# Altium schematic sheet [03] - 28PINS SCHEMATIC.SchDoc (part 2 of 3)
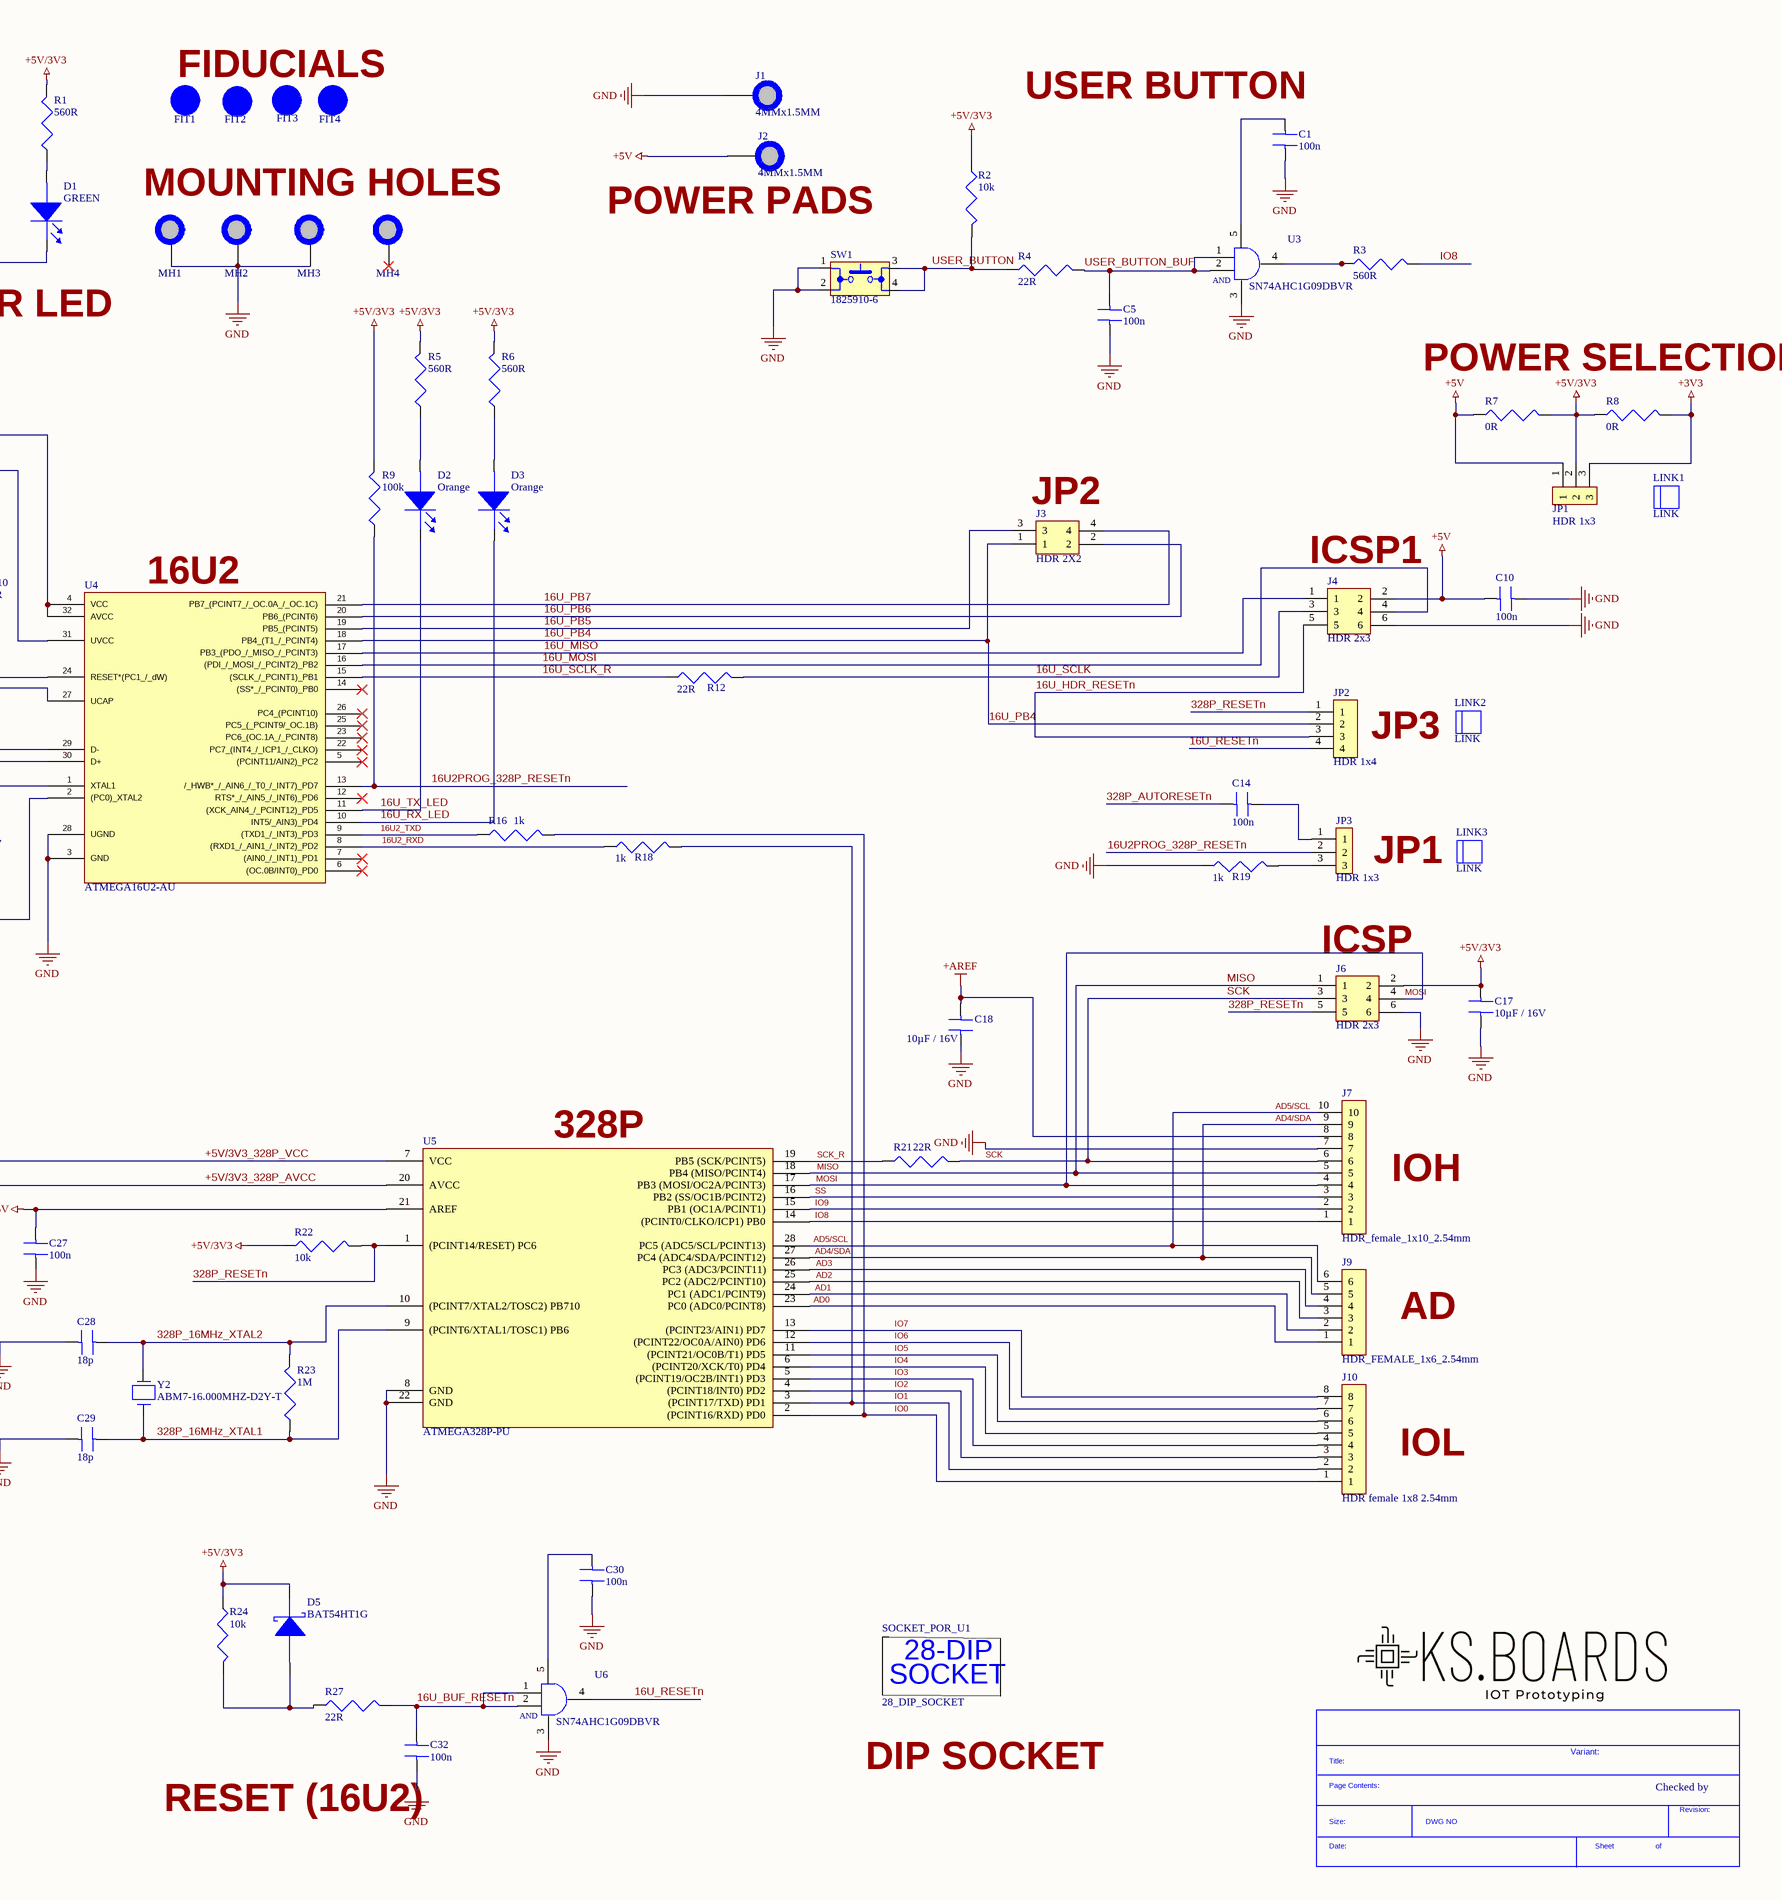
[diagram p2: [03] - 28PINS SCHEMATIC.SchDoc, right]
## Library data of the parts
C1 C2 C5 C7-C10 C14 C20-C23 C26 C27 C30-C33 = C2012X7R1H104M085AA: CAP CER 0.1UF 50V X7R 0805; Manufacturer: TDK; Dielectric Material: Ceramic; Capacitance: 100nF; Tolerance: 20%; Supplier 1: Digi-Key; Supplier Part Number 1: 445-7535-1-ND; Manufacturer Part Number: C2012X7R1H104M085AA; RoHS: Yes; Category: Ceramic Capacitors; Stock 1: 9653; Pricing 1: 1=0,15000, 10=0,10400, 50=0,05900, 100=0,04880, 500=0,03422, 1000=0,02833 (USD); Mount: Surface Mount; Case/Package: 0805; Number of Pins: 2; Weight: 0.000194oz; Case Code (Metric): 2012; Case Code (Imperial): 0805; Min Operating Temperature: -55°C; Max Operating Temperature: 125°C; Packaging: Tape and Reel; Voltage Rating: 50V; Voltage Rating (DC): 50V; Termination: SMD/SMT; Dielectric: X7R; Package Quantity: 1; Resistor Type: Ceramic; Length: 2mm; Height: 0.85mm; Width: 0.049inch; Thickness: 0.037inch; Depth: 1.25mm; Lead Free: Lead Free; REACH SVHC: Unknown; ComponentLink1URL: https://datasheet.ciiva.com/6256/tdkmlcccaprange-6256917.pdf?src-supplier=Digi-Key; ComponentLink1Description: https://datasheet.ciiva.com/6256/tdkmlcccaprange-6256917.pdf?src-supplier=Digi-Key; ComponentLink2URL: https://datasheet.ciiva.com/6256/tdkmlcccaprange-6256919.pdf?src-supplier=Digi-Key; ComponentLink2Description: https://datasheet.ciiva.com/6256/tdkmlcccaprange-6256919.pdf?src-supplier=Digi-Key
C3 C4 C6 C17-C19 C24 C25 = C2012X5R1C106M125AC: CERAMIC CAPACITOR, 10UF, 16V, X5R, 20%, 0805, FULL REEL; Product Range:C Series; Capacitance:10 F; Capacitance Tolerance: 20%; Dielectric Characteristic:X5R; Voltage Rating:16V; Ceramic Capacitor Case:0805 [2012 Metric]; MSL:- ;RoHS Compliant: Yes; Manufacturer: TDK; Supplier 1: Digi-Key; Supplier Part Number 1: 445-4115-2-ND; Manufacturer Part Number: C2012X5R1C106M125AC; RoHS: Yes; Category: Ceramic Capacitors; Mount: Surface Mount; Case/Package: 0805; Number of Pins: 2; Weight: 0.000194oz; Case Code (Metric): 2012; Case Code (Imperial): 0805; Dielectric Material: Ceramic; Min Operating Temperature: -55°C; Max Operating Temperature: 85°C; Termination: SMD/SMT; Capacitance: 10uF; Tolerance: 20%; Voltage Rating: 16V; Packaging: Tape and Reel; Voltage Rating (DC): 16V; Dielectric: X5R; Resistor Type: Ceramic; Package Quantity: 1; Length: 2mm; Height: 1.25mm; Depth: 1.25mm; Width: 0.049inch; Thickness: 0.057inch; REACH SVHC: No SVHC; Lead Free: Lead Free; ComponentLink1URL: https://datasheet.ciiva.com/6289/tdkmlcccaprange-6289238.pdf?src-supplier=Digi-Key; ComponentLink1Description: https://datasheet.ciiva.com/6289/tdkmlcccaprange-6289238.pdf?src-supplier=Digi-Key; ComponentLink2URL: https://datasheet.ciiva.com/22725/1913358-22725558.pdf?src-supplier=Element14; ComponentLink2Description: https://datasheet.ciiva.com/22725/1913358-22725558.pdf?src-supplier=Element14; ComponentLink3URL: https://datasheet.ciiva.com/6252/tdkmlcccaprange-6252105.pdf?src-supplier=Digi-Key; ComponentLink3Description: https://datasheet.ciiva.com/6252/tdkmlcccaprange-6252105.pdf?src-supplier=Digi-Key; ComponentLink4URL: https://datasheet.ciiva.com/6252/tdkmlcccaprange-6252108.pdf?src-supplier=Digi-Key; ComponentLink4Description: https://datasheet.ciiva.com/6252/tdkmlcccaprange-6252108.pdf?src-supplier=Digi-Key; ComponentLink5URL: https://datasheet.ciiva.com/23803/1796654-23803022.pdf?src-supplier=Newark; ComponentLink5Description: https://datasheet.ciiva.com/23803/1796654-23803022.pdf?src-supplier=Newark
C11 C12 = EEE-1AA101WR: Cap Aluminum 100uF 10V 20% (5 X 5.4mm) SMD 50mA 1000 hr 85°C T/R; Manufacturer: Panasonic; Life (Hours): 1000Hour; Supplier 1: Digi-Key; Supplier Part Number 1: PCE3867CT-ND; Manufacturer Part Number: EEE-1AA101WR; RoHS: Yes; Category: Aluminum Electrolytic Capacitors; Stock 1: 120840; Pricing 1: 1=0,34000, 10=0,23100, 50=0,15400, 100=0,13090, 500=0,09240 (USD); Mount: Surface Mount,PCB; Case/Package: Radial; Contact Plating: Tin; Min Operating Temperature: -40°C; Max Operating Temperature: 85°C; Capacitance: 100uF; Tolerance: 20%; Ripple Current: 50mA; Voltage Rating: 10V; Packaging: Tape and Reel; Package Quantity: 1; Voltage Rating (DC): 10V; Termination: SMD/SMT; Ripple Current (AC): 50mA; Diameter: 5mm; Length: 5.5mm; Height: 5.4mm; Height - Seated (Max): 0.213inch; Radiation Hardening: No; Lead Free: Lead Free; REACH SVHC: Unknown; ComponentLink1URL: https://datasheet.ciiva.com/26945/getdatasheetpartid-169213-26945071.pdf?src-supplier=Verical; ComponentLink1Description: https://datasheet.ciiva.com/26945/getdatasheetpartid-169213-26945071.pdf?src-supplier=Verical; ComponentLink2URL: https://datasheet.ciiva.com/2983/aba0000ce2-2983906.pdf?src-supplier=Avnet; ComponentLink2Description: https://datasheet.ciiva.com/2983/aba0000ce2-2983906.pdf?src-supplier=Avnet; ComponentLink3URL: https://datasheet.ciiva.com/30075/11aba0000ce2-30075303.pdf?src-supplier=Onlinecomponents.com; ComponentLink3Description: https://datasheet.ciiva.com/30075/11aba0000ce2-30075303.pdf?src-supplier=Onlinecomponents.com; ComponentLink4URL: https://datasheet.ciiva.com/16427/aba0000ce2-16427544.pdf?src-supplier=Future+Electronics; ComponentLink4Description: https://datasheet.ciiva.com/16427/aba0000ce2-16427544.pdf?src-supplier=Future+Electronics; ComponentLink5URL: https://datasheet.ciiva.com/14598/70255710-14598233.pdf?src-supplier=Allied+Electronics; ComponentLink5Description: https://datasheet.ciiva.com/14598/70255710-14598233.pdf?src-supplier=Allied+Electronics; ComponentLink6URL: https://datasheet.ciiva.com/14605/70255710-14605689.pdf?src-supplier=Allied+Electronics; ComponentLink6Description: https://datasheet.ciiva.com/14605/70255710-14605689.pdf?src-supplier=Allied+Electronics; ComponentLink7URL: https://datasheet.ciiva.com/11673/aba0000ce2-11673882.pdf?src-supplier=Avnet; ComponentLink7Description: https://datasheet.ciiva.com/11673/aba0000ce2-11673882.pdf?src-supplier=Avnet; ComponentLink8URL: https://datasheet.ciiva.com/24027/aba0000ce2-40801-24027541.pdf?src-supplier=Mouser; ComponentLink8Description: https://datasheet.ciiva.com/24027/aba0000ce2-40801-24027541.pdf?src-supplier=Mouser
C13 = C2012X5R1E105K125AA: TDK - C2012X5R1E105K125AA - SMD Multilayer Ceramic Capacitor, 1 µF, 25 V, 0805 [2012 Metric], ± 10%, X5R, C Series; Capacitance: 1uF; Voltage Rating: 25V; Supplier 1: Digi-Key; Supplier Part Number 1: 445-1419-1-ND; Manufacturer: TDK; Manufacturer Part Number: C2012X5R1E105K125AA; RoHS: Yes; Category: Ceramic Capacitors; Stock 1: 31037; Pricing 1: 1=0,23000, 10=0,15800, 50=0,09500, 100=0,08030, 500=0,05492, 1000=0,04858 (USD); Mount: Surface Mount; Case/Package: 0805; Number of Pins: 2; Case Code (Metric): 2012; Case Code (Imperial): 0805; Dielectric Material: Ceramic; Weight: 0.000194oz; Min Operating Temperature: -55°C; Max Operating Temperature: 85°C; Packaging: Tape and Reel; Voltage Rating (DC): 25V; Termination: SMD/SMT; Dielectric: X5R; Tolerance: 10%; Package Quantity: 2000; Resistor Type: Ceramic; Voltage: 25V; Length: 2mm; Width: 0.049inch; Height: 1.25mm; Depth: 1.25mm; Thickness: 0.057inch; Radiation Hardening: No; Lead Free: Lead Free; REACH SVHC: No SVHC; ComponentLink1URL: https://datasheet.ciiva.com/11787/0900766b80c1bb00-11787608.pdf?src-supplier=RSComponents; ComponentLink1Description: https://datasheet.ciiva.com/11787/0900766b80c1bb00-11787608.pdf?src-supplier=RSComponents; ComponentLink2URL: https://datasheet.ciiva.com/16449/e412-c-16449595.pdf?src-supplier=Future+Electronics; ComponentLink2Description: https://datasheet.ciiva.com/16449/e412-c-16449595.pdf?src-supplier=Future+Electronics; ComponentLink3URL: https://datasheet.ciiva.com/28602/1744655-28602171.pdf?src-supplier=Element14; ComponentLink3Description: https://datasheet.ciiva.com/28602/1744655-28602171.pdf?src-supplier=Element14; ComponentLink4URL: https://datasheet.ciiva.com/15192/getdatasheetpartid-726707-15192140.pdf?src-supplier=Verical; ComponentLink4Description: https://datasheet.ciiva.com/15192/getdatasheetpartid-726707-15192140.pdf?src-supplier=Verical
C15 C16 C28 C29 = C0805C180J5GAC7210: Cap Ceramic 18pF 50V C0G 5% SMD 0805 125C Plastic T/R; Manufacturer: KEMET; Supplier 1: Digi-Key; Supplier Part Number 1: 399-C0805C180J5GAC7210CT-ND; Manufacturer Part Number: C0805C180J5GAC7210; RoHS: Yes; Category: Ceramic Capacitors; Stock 1: 14815; Pricing 1: 1=0,12000, 10=0,08600, 50=0,04900, 100=0,04070, 500=0,02852, 1000=0,02361, 2500=0,02197, 5000=0,02010 (USD); Case/Package: 0805; Dielectric Material: Ceramic; Min Operating Temperature: -55°C; Max Operating Temperature: 125°C; Packaging: Tape and Reel; Tolerance: 5%; Capacitance: 18pF; Dielectric: C0G; Voltage Rating (DC): 50V; Length: 2mm; Depth: 1.25mm; Lead Free: Lead Free; ComponentLink1URL: http://components.arrow.com/part/dataview/0323_00325677?src-supplier=Arrow+Europe; ComponentLink1Description: http://components.arrow.com/part/dataview/0323_00325677?src-supplier=Arrow+Europe
D1 D4 = LGL29K-G2J1-24-Z: LED Uni-Color Green 572nm 2-Pin Chip 0603(1608Metric) T/R; Manufacturer: Osram Opto; Lens Color: White; Forward Current: 20mA; Forward Voltage: 2.2V; Luminous Intensity: 5.6mcd; Viewing Angle: 160°; Number of LEDs: 1; Lens Style: Flat,Diffused,Colorless,Rectangular; Reverse Voltage: 12V; Test Current: 2mA; Dominant Wavelength: 570nm; Luminous Flux: 0.012lm; Lens Transparency: Diffused; Lens Size: 0.8mm; Supplier 1: Digi-Key; Supplier Part Number 1: 475-2709-1-ND; Manufacturer Part Number: LGL29K-G2J1-24-Z; RoHS: Yes; Category: Uncategorized; Stock 1: 191201; Pricing 1: 1=0,47000, 10=0,30800, 100=0,20530, 500=0,14198, 1000=0,11832, 2000=0,10649 (USD); Mount: Surface Mount; Case/Package: 0603; Number of Pins: 2; Color: Green; Case Code (Imperial): 0603; Case Code (Metric): 1608; Min Operating Temperature: -40°C; Max Operating Temperature: 100°C; Packaging: Tape and Reel; Number of Elements: 1; Illumination Color: Green; Package Quantity: 5000; Length: 1.3mm; Width: 0.8mm; Height: 0.65mm; Depth: 0.8mm; Radiation Hardening: No; ComponentLink1URL: https://datasheet.ciiva.com/4689/g-l29k-39844-4689584.pdf?src-supplier=Mouser; ComponentLink1Description: https://datasheet.ciiva.com/4689/g-l29k-39844-4689584.pdf?src-supplier=Mouser; ComponentLink2URL: https://datasheet.ciiva.com/15198/getdatasheetpartid-571127-15198411.pdf?src-supplier=Verical; ComponentLink2Description: https://datasheet.ciiva.com/15198/getdatasheetpartid-571127-15198411.pdf?src-supplier=Verical; ComponentLink3URL: https://datasheet.ciiva.com/2112/00077107-0-2112886.pdf?src-supplier=Digi-Key; ComponentLink3Description: https://datasheet.ciiva.com/2112/00077107-0-2112886.pdf?src-supplier=Digi-Key; ComponentLink4URL: https://datasheet.ciiva.com/2112/00077107-0-2112887.pdf?src-supplier=Digi-Key; ComponentLink4Description: https://datasheet.ciiva.com/2112/00077107-0-2112887.pdf?src-supplier=Digi-Key; ComponentLink5URL: https://datasheet.ciiva.com/2112/00077107-0-2112888.pdf?src-supplier=Digi-Key; ComponentLink5Description: https://datasheet.ciiva.com/2112/00077107-0-2112888.pdf?src-supplier=Digi-Key
D2 D3 = LOL29K-H2K1-24-Z: OSRAM - LO L29K-H2K1-24-Z - SMARTLED 0603 ORANGE; Manufacturer: Osram Opto; Lens Color: White; Forward Current: 20mA; Forward Voltage: 2.2V; Luminous Intensity: 9mcd; Viewing Angle: 160°; Test Current: 2mA; Lens Style: Flat,Diffused,Colorless,Rectangular; Dominant Wavelength: 606nm; Luminous Flux: 0.025lm; Number of Elements: 1; Reverse Voltage: 12V; Lens Transparency: Diffused; Lens Size: 0.8mm; Supplier 1: Digi-Key; Supplier Part Number 1: 475-2740-2-ND; Manufacturer Part Number: LOL29K-H2K1-24-Z; RoHS: Yes; Category: Uncategorized; Mount: Surface Mount; Case/Package: 0603; Number of Pins: 2; Color: Orange; Case Code (Metric): 1608; Case Code (Imperial): 0603; Min Operating Temperature: -40°C; Max Operating Temperature: 100°C; Packaging: Tape and Reel; Number of LEDs: 1; Illumination Color: Orange; Package Quantity: 5000; Length: 1.3mm; Width: 0.8mm; Height: 0.65mm; Depth: 0.8mm; Radiation Hardening: No; ComponentLink1URL: https://datasheet.ciiva.com/2112/00077105-0-2112904.pdf?src-supplier=Digi-Key; ComponentLink1Description: https://datasheet.ciiva.com/2112/00077105-0-2112904.pdf?src-supplier=Digi-Key; ComponentLink2URL: https://datasheet.ciiva.com/2112/00077105-0-2112905.pdf?src-supplier=Digi-Key; ComponentLink2Description: https://datasheet.ciiva.com/2112/00077105-0-2112905.pdf?src-supplier=Digi-Key; ComponentLink3URL: https://datasheet.ciiva.com/2112/00077105-0-2112906.pdf?src-supplier=Digi-Key; ComponentLink3Description: https://datasheet.ciiva.com/2112/00077105-0-2112906.pdf?src-supplier=Digi-Key; ComponentLink4URL: https://datasheet.ciiva.com/15198/getdatasheetpartid-693885-15198412.pdf?src-supplier=Verical; ComponentLink4Description: https://datasheet.ciiva.com/15198/getdatasheetpartid-693885-15198412.pdf?src-supplier=Verical
D5 D6 = BAT54HT1G: Small Signal Schottky Diode, Single, 30 V, 200 mA, 800 mV, 600 mA, 150 C ;RoHS Compliant: Yes; Manufacturer: ON Semiconductor / Fairchild; Forward Voltage: 800mV; Forward Current: 200mA; Recovery Time: 5ns; Max Repetitive Reverse Voltage (Vrrm): 30V; Peak Non-Repetitive Surge Current: 600mA; Max Reverse Current: 2uA; Power Dissipation: 200mW; Polarity: Standard; Capacitance: 10pF; Supplier 1: Digi-Key; Supplier Part Number 1: BAT54HT1GOSCT-ND; Manufacturer Part Number: BAT54HT1G; RoHS: Yes; Category: Schottky Diodes; Stock 1: 238317; Pricing 1: 1=0,20000, 10=0,18100, 100=0,07590, 500=0,05962, 1000=0,04140 (USD); Mount: Surface Mount; Number of Pins: 2; Contact Plating: Tin,Matte; Min Operating Temperature: -55°C; Max Operating Temperature: 150°C; Packaging: Tape and Reel; Package Quantity: 3000; Average Rectified Current: 200mA; Reverse Recovery Time: 5ns; Max Forward Surge Current (Ifsm): 600mA; Element Configuration: Single; Max Reverse Voltage (DC): 30V; Max Surge Current: 600mA; Voltage Rating (DC): 30V; Current Rating: 200mA; Output Current: 200mA; Reverse Voltage: 30V; Max Reverse Leakage Current: 2uA; Length: 1.8mm; Width: 1.35mm; Height: 1mm; Radiation Hardening: No; Lead Free: Lead Free; REACH SVHC: No SVHC; ComponentLink1URL: https://datasheet.ciiva.com/4452/bat54ht1g-104602-4452889.pdf?src-supplier=Mouser; ComponentLink1Description: https://datasheet.ciiva.com/4452/bat54ht1g-104602-4452889.pdf?src-supplier=Mouser; ComponentLink2URL: https://datasheet.ciiva.com/1240/1747983-1240762.pdf?src-supplier=Newark; ComponentLink2Description: https://datasheet.ciiva.com/1240/1747983-1240762.pdf?src-supplier=Newark; ComponentLink3URL: https://datasheet.ciiva.com/34301/806549-34301562.pdf?src-supplier=Jameco; ComponentLink3Description: https://datasheet.ciiva.com/34301/806549-34301562.pdf?src-supplier=Jameco; ComponentLink4URL: https://datasheet.ciiva.com/30479/0900766b811a63a9-30479442.pdf?src-supplier=RSComponents; ComponentLink4Description: https://datasheet.ciiva.com/30479/0900766b811a63a9-30479442.pdf?src-supplier=RSComponents; ComponentLink5URL: https://datasheet.ciiva.com/4714/bat54ht1-d-72881-4714706.pdf?src-supplier=Mouser; ComponentLink5Description: https://datasheet.ciiva.com/4714/bat54ht1-d-72881-4714706.pdf?src-supplier=Mouser; ComponentLink6URL: https://datasheet.ciiva.com/910/bat54ht1g-910498.pdf?src-supplier=Digi-Key; ComponentLink6Description: https://datasheet.ciiva.com/910/bat54ht1g-910498.pdf?src-supplier=Digi-Key; ComponentLink7URL: https://datasheet.ciiva.com/46429/1727620-46429206.pdf?src-supplier=Element14; ComponentLink7Description: https://datasheet.ciiva.com/46429/1727620-46429206.pdf?src-supplier=Element14; ComponentLink8URL: https://datasheet.ciiva.com/915/bat54ht1-d-915444.pdf?src-supplier=Digi-Key; ComponentLink8Description: https://datasheet.ciiva.com/915/bat54ht1-d-915444.pdf?src-supplier=Digi-Key; ComponentLink9URL: https://datasheet.ciiva.com/910/bat54ht1g-910499.pdf?src-supplier=Digi-Key; ComponentLink9Description: https://datasheet.ciiva.com/910/bat54ht1g-910499.pdf?src-supplier=Digi-Key; ComponentLink10URL: https://datasheet.ciiva.com/8303/bat54ht1g-8303645.pdf?src-supplier=Avnet; ComponentLink10Description: https://datasheet.ciiva.com/8303/bat54ht1g-8303645.pdf?src-supplier=Avnet; ComponentLink11URL: https://datasheet.ciiva.com/1180/bat54ht1-d-1180251.pdf?src-supplier=Element14; ComponentLink11Description: https://datasheet.ciiva.com/1180/bat54ht1-d-1180251.pdf?src-supplier=Element14; ComponentLink12URL: https://datasheet.ciiva.com/1180/bat54ht1-d-1180252.pdf?src-supplier=Element14; ComponentLink12Description: https://datasheet.ciiva.com/1180/bat54ht1-d-1180252.pdf?src-supplier=Element14; ComponentLink13URL: https://datasheet.ciiva.com/8294/bat54ht1-d-8294645.pdf?src-supplier=Avnet; ComponentLink13Description: https://datasheet.ciiva.com/8294/bat54ht1-d-8294645.pdf?src-supplier=Avnet; ComponentLink14URL: https://datasheet.ciiva.com/915/bat54ht1-d-915445.pdf?src-supplier=Digi-Key; ComponentLink14Description: https://datasheet.ciiva.com/915/bat54ht1-d-915445.pdf?src-supplier=Digi-Key; ComponentLink15URL: https://datasheet.ciiva.com/915/bat54ht1-d-915443.pdf?src-supplier=Digi-Key; ComponentLink15Description: https://datasheet.ciiva.com/915/bat54ht1-d-915443.pdf?src-supplier=Digi-Key; ComponentLink16URL: https://datasheet.ciiva.com/910/bat54ht1g-910497.pdf?src-supplier=Digi-Key; ComponentLink16Description: https://datasheet.ciiva.com/910/bat54ht1g-910497.pdf?src-supplier=Digi-Key; ComponentLink17URL: https://datasheet.ciiva.com/17020/bat54ht1g-17020445.pdf?src-supplier=Future+Electronics; ComponentLink17Description: https://datasheet.ciiva.com/17020/bat54ht1g-17020445.pdf?src-supplier=Future+Electronics; ComponentLink18URL: https://datasheet.ciiva.com/48686/001262925-da-01-en-diode-schottky-30v-bat54ht1g-sod-323-fsc-48686266.pdf?src-supplier=Conrad; ComponentLink18Description: https://datasheet.ciiva.com/48686/001262925-da-01-en-diode-schottky-30v-bat54ht1g-sod-323-fsc-48686266.pdf?src-supplier=Conrad
FB1-FB3 = MPZ2012S601AT000: FERRITE BEAD 600 OHM 0805 1LN; Manufacturer: TDK; Impedance: 600R; Current Rating: 2A; DC Resistance (DCR): 100mR; Supplier 1: Digi-Key; Supplier Part Number 1: 445-2206-1-ND; Manufacturer Part Number: MPZ2012S601AT000; RoHS: Yes; Category: Ferrite Beads and Chips; Stock 1: 273606; Pricing 1: 1=0,11000, 10=0,09200, 25=0,08240, 50=0,06040, 100=0,05220, 250=0,04116, 500=0,03478, 1000=0,02928 (USD); Mount: Surface Mount; Case/Package: 0805; Case Code (Metric): 2012; Case Code (Imperial): 0805; Packaging: Tape and Reel; Package Quantity: 1; Max DC Current: 2A; Length: 0.079inch; Height: 0.041inch; Width: 0.049inch; REACH SVHC: No SVHC; Lead Free: Lead Free; ComponentLink1URL: https://datasheet.ciiva.com/46634/beads-commercial-power-mpz-en-46634377.pdf?src-supplier=Digi-Key; ComponentLink1Description: https://datasheet.ciiva.com/46634/beads-commercial-power-mpz-en-46634377.pdf?src-supplier=Digi-Key; ComponentLink2URL: https://datasheet.ciiva.com/46634/beads-commercial-power-mpz-en-46634606.pdf?src-supplier=Digi-Key; ComponentLink2Description: https://datasheet.ciiva.com/46634/beads-commercial-power-mpz-en-46634606.pdf?src-supplier=Digi-Key; ComponentLink3URL: https://datasheet.ciiva.com/46634/beads-commercial-power-mpz-en-46634335.pdf?src-supplier=Digi-Key; ComponentLink3Description: https://datasheet.ciiva.com/46634/beads-commercial-power-mpz-en-46634335.pdf?src-supplier=Digi-Key
FIT1-FIT4 = FIT_1MM: fiducial 40 mil  Diameter 120 mil Mask
J1 J2 = PAD_WITH_HOLE_4mm_1.5mm: Pad with hole 4mm x 1.5mm
J3 = 929665-02-18-EU: Headers & Wire Housings 36 PS/2R/SRT/.235 .210/ALL 10U/ROHS; Manufacturer: 3M; Gender: Male; Connector Type: Male Pin; Current Rating: 2.5A; Voltage Rating: 1.5kV; Number of Positions: 36; Pitch: 0.1inch; Supplier 1: Digi-Key; Supplier Part Number 1: 3M156317-36-ND; Manufacturer Part Number: 929665-02-18-EU; RoHS: Yes; Category: Headers and Wire Housings; Pricing 1: 1=6,01000, 10=5,77200, 25=5,29040, 50=5,05000, 100=4,80960, 250=4,20840, 500=4,08816 (USD); Mount: Through Hole; Contact Plating: Gold; Contact Material: Copper Alloy; Color: Black; Number of Rows: 2; Termination: Solder; Contact Gender: Male; Package Quantity: 300; Packaging: Bulk; Row Spacing: 0.1inch; Contact Mating Length: 0.235inch; ComponentLink1URL: https://datasheet.ciiva.com/6821/ts0769-6821293.pdf?src-supplier=Digi-Key; ComponentLink1Description: https://datasheet.ciiva.com/6821/ts0769-6821293.pdf?src-supplier=Digi-Key
J4 J6 = 67997-106HLF: CONN HEADER 6POS .100 STR 30AU; Manufacturer: Amphenol FCI; Number of Contacts: 6; Insulation Resistance: 5GR; Max Voltage Rating (AC): 1.5kV; Gender: Male; Current Rating: 3A; Connector Type: Male Pin; Pitch: 2.54mm; Row Spacing: 0.1inch; Contact Post Length: 3.05mm; Supplier 1: Digi-Key; Supplier Part Number 1: 609-3393-ND; Manufacturer Part Number: 67997-106HLF; RoHS: Yes; Category: Headers and Wire Housings; Stock 1: 1303; Pricing 1: 1=1,78000, 10=1,61400, 100=1,38370, 500=1,15308, 1000=0,98835, 5000=0,87634, 10000=0,85657 (USD); Mount: Through Hole; Contact Plating: Gold,GXT; Housing Color: Black; Contact Material: Bronze; Color: Black; Housing Material: Thermoplastic; Min Operating Temperature: -65°C; Max Operating Temperature: 125°C; Termination: Through Hole; Number of Rows: 2; Orientation: Straight; Number of Positions: 6; Packaging: Bulk; Package Quantity: 100; Contact Gender: Male; Voltage Rating: 1.5kV; Length: 7.62mm; Contact Mating Length: 0.23inch; Depth: 4.83mm; Radiation Hardening: No; Lead Free: Lead Free; REACH SVHC: No SVHC; Flammability Rating: UL94 V-0; ComponentLink1URL: https://datasheet.ciiva.com/5153/67996-222463-5153820.pdf?src-supplier=Mouser; ComponentLink1Description: https://datasheet.ciiva.com/5153/67996-222463-5153820.pdf?src-supplier=Mouser; ComponentLink2URL: https://datasheet.ciiva.com/16726/67996-16726286.pdf?src-supplier=Avnet+Europe; ComponentLink2Description: https://datasheet.ciiva.com/16726/67996-16726286.pdf?src-supplier=Avnet+Europe; ComponentLink3URL: https://datasheet.ciiva.com/722/67996-722044.pdf?src-supplier=Digi-Key; ComponentLink3Description: https://datasheet.ciiva.com/722/67996-722044.pdf?src-supplier=Digi-Key; ComponentLink4URL: https://datasheet.ciiva.com/10149/67996-10149221.pdf?src-supplier=Avnet; ComponentLink4Description: https://datasheet.ciiva.com/10149/67996-10149221.pdf?src-supplier=Avnet; ComponentLink5URL: https://datasheet.ciiva.com/46393/1876884-46393067.pdf?src-supplier=Element14; ComponentLink5Description: https://datasheet.ciiva.com/46393/1876884-46393067.pdf?src-supplier=Element14
J5 = 10118193-0001LF: CONN USB MICRO B RECPT SMT R/A; Manufacturer: Amphenol FCI; Number of Terminals/Pins: 5; Gender: Female; Connector Type: USB,Receptacle; Number of Ports: 1; Current Rating: 1.8A; Insulation Resistance: 1GR; Max Voltage Rating (AC): 100V; Pitch: 0.65mm; Supplier 1: Digi-Key; Supplier Part Number 1: 609-4616-1-ND; Manufacturer Part Number: 10118193-0001LF; RoHS: Yes; Category: USB Connectors; Stock 1: 68220; Pricing 1: 1=0,45000, 10=0,43000, 25=0,36840, 50=0,31320, 100=0,30090, 250=0,27016, 500=0,25788 (USD); Mount: Surface Mount,Horizontal; Contact Plating: Gold; Contact Material: Copper Alloy; Color: Black; Housing Material: Polymer; Min Operating Temperature: -55°C; Max Operating Temperature: 85°C; Termination: Solder; Packaging: Tape and Reel; Number of Contacts: 5; Orientation: Right Angle; Package Quantity: 1200; Voltage Rating: 100V; Features: Shielded; Length: 7.86mm; Depth: 5.67mm; Radiation Hardening: No; Flammability Rating: UL94 V-0; ComponentLink1URL: https://datasheet.ciiva.com/851/10118193-851106.pdf?src-supplier=Digi-Key; ComponentLink1Description: https://datasheet.ciiva.com/851/10118193-851106.pdf?src-supplier=Digi-Key; ComponentLink2URL: https://datasheet.ciiva.com/26853/getdatasheetpartid-418618-26853893.pdf?src-supplier=Verical; ComponentLink2Description: https://datasheet.ciiva.com/26853/getdatasheetpartid-418618-26853893.pdf?src-supplier=Verical; ComponentLink3URL: https://datasheet.ciiva.com/4598/10118193ac-197151-4598799.pdf?src-supplier=Mouser; ComponentLink3Description: https://datasheet.ciiva.com/4598/10118193ac-197151-4598799.pdf?src-supplier=Mouser; ComponentLink4URL: https://datasheet.ciiva.com/14802/10118193-0001lf-webpage-14802386.pdf?src-supplier=Arrow+Electronics; ComponentLink4Description: https://datasheet.ciiva.com/14802/10118193-0001lf-webpage-14802386.pdf?src-supplier=Arrow+Electronics; ComponentLink5URL: https://datasheet.ciiva.com/851/10118193-851107.pdf?src-supplier=Digi-Key; ComponentLink5Description: https://datasheet.ciiva.com/851/10118193-851107.pdf?src-supplier=Digi-Key; ComponentLink6URL: https://datasheet.ciiva.com/851/10118193-851108.pdf?src-supplier=Digi-Key; ComponentLink6Description: https://datasheet.ciiva.com/851/10118193-851108.pdf?src-supplier=Digi-Key; ComponentLink7URL: https://datasheet.ciiva.com/14618/70236827-14618887.pdf?src-supplier=Allied+Electronics; ComponentLink7Description: https://datasheet.ciiva.com/14618/70236827-14618887.pdf?src-supplier=Allied+Electronics
J7 = 66951-010LF: CONN RCPT 10POS 0.1 GOLD PCB; Manufacturer: Amphenol FCI; Current Rating: 3A; Voltage Rating: 1.25kV; Contact Resistance: 15mR; Gender: Female; Connector Type: Receptacle,Socket; Number of Positions: 10; Pitch: 2.54mm; Supplier 1: Digi-Key; Manufacturer Part Number: 66951-010LF; RoHS: Yes; Category: Headers and Wire Housings; Stock 1: 757; Pricing 1: 1=2,02000, 10=1,83400, 100=1,57210, 500=1,31006, 1000=1,12290, 5000=0,99564, 10000=0,97318 (USD); Mount: Through Hole; Color: Black; Contact Plating: Gold; Contact Material: Copper,Brass; Housing Color: Black; Housing Material: Thermoplastic; Min Operating Temperature: -65°C; Max Operating Temperature: 125°C; Package Quantity: 23; Number of Rows: 1; Packaging: Rail/Tube; Contact Gender: Female; Orientation: Straight; Termination: Solder; Max Voltage Rating (AC): 1.25kV; Number of Contacts: 10; Length: 25.4mm; Width: 5.08mm; Depth: 5.08mm; Lead Free: Lead Free; ComponentLink1URL: https://datasheet.ciiva.com/746/66951-746016.pdf?src-supplier=Digi-Key; ComponentLink1Description: https://datasheet.ciiva.com/746/66951-746016.pdf?src-supplier=Digi-Key; ComponentLink2URL: https://datasheet.ciiva.com/5155/66951-85357-5155344.pdf?src-supplier=Mouser; ComponentLink2Description: https://datasheet.ciiva.com/5155/66951-85357-5155344.pdf?src-supplier=Mouser; ComponentLink3URL: https://datasheet.ciiva.com/10137/66951-10137498.pdf?src-supplier=Avnet; ComponentLink3Description: https://datasheet.ciiva.com/10137/66951-10137498.pdf?src-supplier=Avnet; ComponentLink4URL: https://datasheet.ciiva.com/16727/66951-16727150.pdf?src-supplier=Avnet+Europe; ComponentLink4Description: https://datasheet.ciiva.com/16727/66951-16727150.pdf?src-supplier=Avnet+Europe; Supplier Part Number 1: 609-2240-ND
J8 J10 = M20-7820842: 2.54mm (0.1") Pitch SIL Vertical PC Tail Socket Assembly, selective gold + tin, 8 contacts; Manufacturer: Harwin; Number of Positions: 8; Connector Type: Receptacle,Socket; Max Current Rating: 3A; Contact Resistance: 20mR; Supplier 1: Digi-Key; Supplier Part Number 1: 952-1823-ND; Manufacturer Part Number: M20-7820842; RoHS: Yes; Category: Headers and Wire Housings; Stock 1: 1525; Pricing 1: 1=1,10000, 10=0,97200, 100=0,83820, 500=0,68580, 1000=0,60960, 5000=0,53340, 10000=0,50673 (USD); Mount: Through Hole; Case/Package: SIL; Weight: 0.025397oz; Contact Plating: Tin,Gold; Color: Black; Contact Material: Bronze; Housing Material: Polyamide; Housing Color: Black; Min Operating Temperature: -40°C; Max Operating Temperature: 105°C; Termination: Solder; Number of Rows: 1; Package Quantity: 29; Packaging: Rail/Tube; Orientation: Straight; Number of Contacts: 8; Gender: Female; Contact Gender: Female; Length: 20.72mm; Pitch: 2.54mm; Depth: 2.5mm; Radiation Hardening: No; ComponentLink1URL: https://datasheet.ciiva.com/16732/m20-782-16732663.pdf?src-supplier=Avnet+Europe; ComponentLink1Description: https://datasheet.ciiva.com/16732/m20-782-16732663.pdf?src-supplier=Avnet+Europe; ComponentLink2URL: https://datasheet.ciiva.com/9480/m20-782-9480074.pdf?src-supplier=Avnet; ComponentLink2Description: https://datasheet.ciiva.com/9480/m20-782-9480074.pdf?src-supplier=Avnet
J9 = M20-7820646: 06-WAY SIL VERT SOCKET L/FREE; Manufacturer: Harwin; Number of Contacts: 6; Gender: Female; Connector Type: Receptacle,Socket; Max Current Rating: 3A; Contact Resistance: 20mR; Pitch: 2.54mm; Supplier 1: Digi-Key; Supplier Part Number 1: 952-1809-ND; Manufacturer Part Number: M20-7820646; RoHS: Yes; Category: Headers and Wire Housings; Stock 1: 2220; Pricing 1: 1=0,96000, 10=0,84200, 100=0,72600, 500=0,59400, 1000=0,52800, 5000=0,46200, 10000=0,43890 (USD); Mount: Through Hole; Case/Package: SIL; Housing Material: Nylon; Color: Black; Contact Plating: Tin; Contact Material: Bronze; Housing Color: Black; Min Operating Temperature: -40°C; Max Operating Temperature: 105°C; Termination: Solder; Number of Rows: 1; Number of Positions: 6; Packaging: Rail/Tube; Orientation: Straight; Contact Gender: Female; Package Quantity: 38; Length: 15.64mm; Depth: 2.5mm; Radiation Hardening: No; ComponentLink1URL: http://components.arrow.com/part/dataview/0323_00725884?src-supplier=Arrow+Europe; ComponentLink1Description: http://components.arrow.com/part/dataview/0323_00725884?src-supplier=Arrow+Europe; ComponentLink2URL: http://www.harwin.com/include/downloads/pdfs/2010PAGE120.PDF?src-supplier=Avnet; ComponentLink2Description: http://www.harwin.com/include/downloads/pdfs/2010PAGE120.PDF?src-supplier=Avnet; ComponentLink3URL: https://cdn.harwin.com/pdfs/M20-782.pdf?src-supplier=Digi-Key; ComponentLink3Description: https://cdn.harwin.com/pdfs/M20-782.pdf?src-supplier=Digi-Key; ComponentLink4URL: https://cdn.harwin.com/pdfs/Harwin_PC_Connectors_M20.pdf?src-supplier=Avnet+Europe; ComponentLink4Description: https://cdn.harwin.com/pdfs/Harwin_PC_Connectors_M20.pdf?src-supplier=Avnet+Europe; ComponentLink5URL: https://cdn.harwin.com/pdfs/Harwin_PC_Connectors_M20.pdf?src-supplier=RSComponents; ComponentLink5Description: https://cdn.harwin.com/pdfs/Harwin_PC_Connectors_M20.pdf?src-supplier=RSComponents; ComponentLink6URL: https://cdn.harwin.com/pdfs/Harwin_PC_Connectors_M20.pdf?src-supplier=Mouser; ComponentLink6Description: https://cdn.harwin.com/pdfs/Harwin_PC_Connectors_M20.pdf?src-supplier=Mouser; ComponentLink7URL: https://cdn.harwin.com/pdfs/Harwin_PC_Connectors_M20.pdf?src-supplier=TTI; ComponentLink7Description: https://cdn.harwin.com/pdfs/Harwin_PC_Connectors_M20.pdf?src-supplier=TTI
JP1 JP3 = 68000-103HLF: Conn Unshrouded Header HDR 3 POS 2.54mm Solder ST Thru-Hole Bulk; Manufacturer: Amphenol FCI; Number of Positions: 3; Connector Type: Male Pin; Current Rating: 3A; Voltage Rating: 1.5kV; Insulation Resistance: 5GR; Gender: Male; Contact Post Length: 2.41mm; Supplier 1: Digi-Key; Supplier Part Number 1: 609-3461-ND; Manufacturer Part Number: 68000-103HLF; RoHS: Yes; Category: Headers and Wire Housings; Stock 1: 36438; Pricing 1: 1=0,29000, 10=0,27900, 100=0,19500, 500=0,16716, 1000=0,13930, 5000=0,11940, 10000=0,11144 (USD); Mount: Through Hole; Contact Plating: Gold,GXT; Contact Material: Bronze; Color: Black; Housing Color: Black; Housing Material: Thermoplastic; Min Operating Temperature: -65°C; Max Operating Temperature: 125°C; Number of Rows: 1; Termination: Through Hole; Packaging: Bulk; Number of Contacts: 3; Contact Gender: Male; Package Quantity: 100; Max Voltage Rating (AC): 1.5kV; Orientation: Straight; Length: 7.62mm; Pitch: 2.54mm; Contact Mating Length: 5.84mm; Depth: 2.41mm; Radiation Hardening: No; Flammability Rating: UL94 V-0; REACH SVHC: No SVHC; ComponentLink1URL: https://datasheet.ciiva.com/5157/68000-274283-5157301.pdf?src-supplier=Mouser; ComponentLink1Description: https://datasheet.ciiva.com/5157/68000-274283-5157301.pdf?src-supplier=Mouser; ComponentLink2URL: https://datasheet.ciiva.com/10149/68000-10149754.pdf?src-supplier=Avnet; ComponentLink2Description: https://datasheet.ciiva.com/10149/68000-10149754.pdf?src-supplier=Avnet; ComponentLink3URL: https://datasheet.ciiva.com/46392/1914865-46392021.pdf?src-supplier=Element14; ComponentLink3Description: https://datasheet.ciiva.com/46392/1914865-46392021.pdf?src-supplier=Element14
JP2 = 68001-204HLF: CONN HEADER VERT 4POS 2.54MM; Manufacturer: Amphenol FCI; Current Rating: 3A; Voltage Rating: 1.5kV; Connector Type: Male Pin; Gender: Male; Number of Positions: 4; Insulation Resistance: 5GR; Contact Post Length: 3.05mm; Supplier 1: Digi-Key; Supplier Part Number 1: 609-3402-ND; Manufacturer Part Number: 68001-204HLF; RoHS: Yes; Category: Headers and Wire Housings; Stock 1: 2372; Pricing 1: 1=0,38000, 10=0,35700, 100=0,25010, 500=0,21442, 1000=0,17868, 5000=0,15315, 10000=0,14294 (USD); Mount: Through Hole; Color: Black; Contact Plating: Gold,GXT; Contact Material: Bronze; Housing Material: Thermoplastic; Min Operating Temperature: -65°C; Max Operating Temperature: 125°C; Package Quantity: 100; Number of Rows: 1; Packaging: Bulk; Contact Gender: Male; Termination: Solder; Number of Contacts: 4; Orientation: Straight; Pitch: 2.54mm; Contact Mating Length: 0.23inch; Radiation Hardening: No; Flammability Rating: UL94 V-0; ComponentLink1URL: https://datasheet.ciiva.com/5164/68000-274255-5164127.pdf?src-supplier=Mouser; ComponentLink1Description: https://datasheet.ciiva.com/5164/68000-274255-5164127.pdf?src-supplier=Mouser; ComponentLink2URL: https://datasheet.ciiva.com/726/68000-726529.pdf?src-supplier=Digi-Key; ComponentLink2Description: https://datasheet.ciiva.com/726/68000-726529.pdf?src-supplier=Digi-Key
L1 = L1210R2R2MDWIT: FIXED IND 2.2UH 2A 80 MOHM SMD; Manufacturer: KEMET; Core Material: Ferrite; Tolerance: 20%; Shielding: Unshielded; Self Resonant Frequency: 190MHz; DC Resistance (DCR): 80mR; Test Frequency: 100kHz; DC Current: 1.13A; Supplier 1: Digi-Key; Supplier Part Number 1: 399-9598-1-ND; Manufacturer Part Number: L1210R2R2MDWIT; RoHS: Yes; Category: Fixed Inductors; Stock 1: 16685; Pricing 1: 1=0,48000, 10=0,41700, 25=0,38680, 50=0,32720, 100=0,29750, 250=0,27964, 500=0,24990 (USD); Mount: Surface Mount; Case/Package: 1210; Case Code (Metric): 3225; Case Code (Imperial): 1210; Min Operating Temperature: -40°C; Max Operating Temperature: 105°C; Inductance: 2.2uH; Max DC Current: 2A; Package Quantity: 1000; Current Rating: 2A; Packaging: Tape and Reel; Inductance Tolerance: 20%; Resistor Type: Wirewound,Ceramic; Termination: SMD/SMT; Length: 0.126inch; Width: 0.098inch; Height: 2.5mm; Height - Seated (Max): 0.106inch; Depth: 2.7mm; Radiation Hardening: No; REACH SVHC: No SVHC; Military Standard: Not; ComponentLink1URL: https://datasheet.ciiva.com/4957/f3115-4957838.pdf?src-supplier=Mouser; ComponentLink1Description: https://datasheet.ciiva.com/4957/f3115-4957838.pdf?src-supplier=Mouser; ComponentLink2URL: https://datasheet.ciiva.com/6691/f3115-6691487.pdf?src-supplier=Digi-Key; ComponentLink2Description: https://datasheet.ciiva.com/6691/f3115-6691487.pdf?src-supplier=Digi-Key; ComponentLink3URL: https://datasheet.ciiva.com/8512/f3115-8512543.pdf?src-supplier=Avnet; ComponentLink3Description: https://datasheet.ciiva.com/8512/f3115-8512543.pdf?src-supplier=Avnet; ComponentLink4URL: https://datasheet.ciiva.com/17280/f3115-17280270.pdf?src-supplier=Avnet+Europe; ComponentLink4Description: https://datasheet.ciiva.com/17280/f3115-17280270.pdf?src-supplier=Avnet+Europe; ComponentLink5URL: https://datasheet.ciiva.com/22685/27262-22685038.pdf?src-supplier=Element14; ComponentLink5Description: https://datasheet.ciiva.com/22685/27262-22685038.pdf?src-supplier=Element14
LINK1-LINK3 = QPC02SXGN-RC: CONN JUMPER SHORTING .100" GOLD; Manufacturer: Sullins; Number of Positions: 2; Pitch: 0.1inch; Supplier 1: Digi-Key; Supplier Part Number 1: S9337-ND; Manufacturer Part Number: QPC02SXGN-RC; RoHS: Yes; Category: Connectors; Stock 1: 838870; Pricing 1: 1=0,10000, 25=0,04400, 50=0,03780, 250=0,03152, 750=0,02835, 1000=0,02646, 12000=0,02016, 24000=0,01827, 48000=0,01820 (USD); Case/Package: 100; Contact Plating: Gold; Package Quantity: 2000; Packaging: Bulk; Height: 0.235inch; Lead Free: Lead Free; ComponentLink1URL: https://datasheet.ciiva.com/767/284-sxgn-11510-767869.pdf?src-supplier=Digi-Key; ComponentLink1Description: https://datasheet.ciiva.com/767/284-sxgn-11510-767869.pdf?src-supplier=Digi-Key
MH1-MH3 = MH_7.4MM_3.2MM: Mounting hole 7.4mm diameter 3.4mm drill hole
MH4 = MH_7.4_non_plated: Hole_7.4mm Diameter [Non Copper]_3.2mm Droll NPTH
R1 R3 R5 R6 R20 = RC0805FR-07560RL: Surface Mount Thick Film Resistor, RC Series, 560 ohm, 125 mW, - 1%, 150 V, 0805 [2012 Metric]; Manufacturer: Yageo; Temperature Coefficient: 100ppm/°C; Power Rating: 125mW; Voltage Rating: 150V; Supplier 1: Digi-Key; Supplier Part Number 1: 311-560CRCT-ND; Manufacturer Part Number: RC0805FR-07560RL; RoHS: Yes; Category: Chip SMD Resistors; Pricing 1: 1=0,10000, 10=0,03600, 100=0,01470, 1000=0,00660, 2500=0,00573 (USD); Case/Package: 0805; Case Code (Metric): 2012; Case Code (Imperial): 0805; Weight: 0.000194oz; Min Operating Temperature: -55°C; Max Operating Temperature: 155°C; Tolerance: 1%; Resistance: 560R; Resistor Type: Thick Film; Packaging: Tape and Reel; Package Quantity: 1; Number of Terminations: 2; Termination: SMD/SMT; Max Power Dissipation: 125mW; Features: Moisture Resistant; Length: 2mm; Width: 0.049inch; Height: 0.5mm; Depth: 1.25mm; REACH SVHC: Unknown; Lead Free: Lead Free; Military Standard: Not; ComponentLink1URL: https://datasheet.ciiva.com/2457/pyu-r-int-thick-7-2457140.pdf?src-supplier=Digi-Key; ComponentLink1Description: https://datasheet.ciiva.com/2457/pyu-r-int-thick-7-2457140.pdf?src-supplier=Digi-Key; ComponentLink2URL: https://datasheet.ciiva.com/2457/pyu-r-int-thick-7-2457141.pdf?src-supplier=Digi-Key; ComponentLink2Description: https://datasheet.ciiva.com/2457/pyu-r-int-thick-7-2457141.pdf?src-supplier=Digi-Key; ComponentLink3URL: https://datasheet.ciiva.com/5561/rc0805-5561861.pdf?src-supplier=Mouser; ComponentLink3Description: https://datasheet.ciiva.com/5561/rc0805-5561861.pdf?src-supplier=Mouser; ComponentLink4URL: https://datasheet.ciiva.com/7941/444164-7941813.pdf?src-supplier=Element14; ComponentLink4Description: https://datasheet.ciiva.com/7941/444164-7941813.pdf?src-supplier=Element14; ComponentLink5URL: https://datasheet.ciiva.com/2457/pyu-r-int-thick-7-2457142.pdf?src-supplier=Digi-Key; ComponentLink5Description: https://datasheet.ciiva.com/2457/pyu-r-int-thick-7-2457142.pdf?src-supplier=Digi-Key; ComponentLink6URL: https://datasheet.ciiva.com/7941/444164-7941814.pdf?src-supplier=Element14; ComponentLink6Description: https://datasheet.ciiva.com/7941/444164-7941814.pdf?src-supplier=Element14
R2 R11 R22 R24-R26 = RC0805FR-0710KL: RES SMD 10K OHM 1% 1/8W 0805; Manufacturer: Yageo; Resistance: 10kR; Temperature Coefficient: 100ppm/°C; Power Rating: 125mW; Voltage Rating: 150V; Supplier 1: Digi-Key; Supplier Part Number 1: 311-10.0KCRCT-ND; Manufacturer Part Number: RC0805FR-0710KL; RoHS: Yes; Category: Chip SMD Resistors; Stock 1: 16566844; Pricing 1: 1=0,10000, 10=0,03600, 100=0,01470, 1000=0,00660, 2500=0,00573 (USD); Case/Package: 0805; Case Code (Imperial): 0805; Case Code (Metric): 2012; Min Operating Temperature: -55°C; Max Operating Temperature: 155°C; Tolerance: 1%; Resistor Type: Thick Film; Packaging: Tape and Reel; Package Quantity: 1; Termination: SMD/SMT; Number of Terminations: 2; Max Power Dissipation: 125mW; Features: Moisture Resistant; Length: 2mm; Width: 0.049inch; Height: 0.024inch; Depth: 1.25mm; REACH SVHC: Unknown; Lead Free: Lead Free; Military Standard: Not; ComponentLink1URL: https://datasheet.ciiva.com/11808/0900766b8106beab-11808151.pdf?src-supplier=RSComponents; ComponentLink1Description: https://datasheet.ciiva.com/11808/0900766b8106beab-11808151.pdf?src-supplier=RSComponents; ComponentLink2URL: https://datasheet.ciiva.com/12669/rc0805-12669688.pdf?src-supplier=Mouser; ComponentLink2Description: https://datasheet.ciiva.com/12669/rc0805-12669688.pdf?src-supplier=Mouser; ComponentLink3URL: https://datasheet.ciiva.com/46447/444164-46447563.pdf?src-supplier=Element14; ComponentLink3Description: https://datasheet.ciiva.com/46447/444164-46447563.pdf?src-supplier=Element14; ComponentLink4URL: https://datasheet.ciiva.com/2456/pyu-r-int-thick-7-2456972.pdf?src-supplier=Digi-Key; ComponentLink4Description: https://datasheet.ciiva.com/2456/pyu-r-int-thick-7-2456972.pdf?src-supplier=Digi-Key; ComponentLink5URL: https://datasheet.ciiva.com/2456/pyu-r-int-thick-7-2456973.pdf?src-supplier=Digi-Key; ComponentLink5Description: https://datasheet.ciiva.com/2456/pyu-r-int-thick-7-2456973.pdf?src-supplier=Digi-Key; ComponentLink6URL: https://datasheet.ciiva.com/2456/pyu-r-int-thick-7-2456974.pdf?src-supplier=Digi-Key; ComponentLink6Description: https://datasheet.ciiva.com/2456/pyu-r-int-thick-7-2456974.pdf?src-supplier=Digi-Key; ComponentLink7URL: https://datasheet.ciiva.com/16747/rc0805-16747087.pdf?src-supplier=Future+Electronics; ComponentLink7Description: https://datasheet.ciiva.com/16747/rc0805-16747087.pdf?src-supplier=Future+Electronics
R4 R12 R13 R15 R21 R27 R28 = RC0805FR-0722RL: RES SMD 22 OHM 1% 1/8W 0805; Manufacturer: Yageo; Temperature Coefficient: 100ppm/°C; Max Power Dissipation: 125mW; Working Voltage: 150V; Supplier 1: Digi-Key; Supplier Part Number 1: 311-22.0CRCT-ND; Manufacturer Part Number: RC0805FR-0722RL; RoHS: Yes; Category: Chip SMD Resistors; Stock 1: 471246; Pricing 1: 1=0,10000, 10=0,03600, 100=0,01470, 1000=0,00660, 2500=0,00573 (USD); Case/Package: 0805; Case Code (Metric): 2012; Case Code (Imperial): 0805; Min Operating Temperature: -55°C; Max Operating Temperature: 155°C; Resistor Type: Thick Film; Resistance: 22R; Tolerance: 1%; Packaging: Tape and Reel; Features: Moisture Resistant; Number of Terminations: 2; Termination: SMD/SMT; Power Rating: 125mW; Voltage Rating: 150V; Package Quantity: 1; Length: 0.079inch; Width: 0.049inch; Height: 0.024inch; Depth: 1.25mm; REACH SVHC: Unknown; Lead Free: Lead Free; Military Standard: Not; ComponentLink1URL: https://datasheet.ciiva.com/11819/0900766b8106beab-11819837.pdf?src-supplier=RSComponents; ComponentLink1Description: https://datasheet.ciiva.com/11819/0900766b8106beab-11819837.pdf?src-supplier=RSComponents; ComponentLink2URL: https://datasheet.ciiva.com/2457/pyu-r-int-thick-7-2457044.pdf?src-supplier=Digi-Key; ComponentLink2Description: https://datasheet.ciiva.com/2457/pyu-r-int-thick-7-2457044.pdf?src-supplier=Digi-Key; ComponentLink3URL: https://datasheet.ciiva.com/46447/444164-46447574.pdf?src-supplier=Element14; ComponentLink3Description: https://datasheet.ciiva.com/46447/444164-46447574.pdf?src-supplier=Element14; ComponentLink4URL: https://datasheet.ciiva.com/2457/pyu-r-int-thick-7-2457045.pdf?src-supplier=Digi-Key; ComponentLink4Description: https://datasheet.ciiva.com/2457/pyu-r-int-thick-7-2457045.pdf?src-supplier=Digi-Key; ComponentLink5URL: https://datasheet.ciiva.com/2457/pyu-r-int-thick-7-2457046.pdf?src-supplier=Digi-Key; ComponentLink5Description: https://datasheet.ciiva.com/2457/pyu-r-int-thick-7-2457046.pdf?src-supplier=Digi-Key; ComponentLink6URL: https://datasheet.ciiva.com/12667/rc0805-12667371.pdf?src-supplier=Mouser; ComponentLink6Description: https://datasheet.ciiva.com/12667/rc0805-12667371.pdf?src-supplier=Mouser
R7 R8 R10 R14 = RC0805JR-070RL: Surface Mount Thick Film Resistor, RC Series, 125 mW, - 5%, 150 V, 0805 [2012 Metric]; Manufacturer: Yageo; Resistance: 0mR; Power Rating: 125mW; Voltage Rating: 150V; Temperature Coefficient: 200ppm/°C; Supplier 1: Digi-Key; Supplier Part Number 1: 311-0.0ARCT-ND; Manufacturer Part Number: RC0805JR-070RL; RoHS: Yes; Category: Chip SMD Resistors; Stock 1: 4474861; Pricing 1: 1=0,10000, 10=0,03100, 25=0,02240, 50=0,01720, 100=0,01260, 250=0,00964, 500=0,00770, 1000=0,00567 (USD); Case/Package: 0805; Number of Pins: 2; Contact Plating: Tin,Matte; Case Code (Imperial): 0805; Case Code (Metric): 2012; Min Operating Temperature: -55°C; Max Operating Temperature: 155°C; Resistor Type: Thick Film; Tolerance: 5%; Packaging: Tape and Reel; Voltage Rating (DC): 150V; Termination: SMD/SMT; Length: 2mm; Width: 1.25mm; Height: 0.5mm; Depth: 1.25mm; Radiation Hardening: No; REACH SVHC: Unknown; Military Standard: Not; Lead Free: Lead Free; ComponentLink1URL: https://datasheet.ciiva.com/7941/1738694-7941861.pdf?src-supplier=Element14; ComponentLink1Description: https://datasheet.ciiva.com/7941/1738694-7941861.pdf?src-supplier=Element14; ComponentLink2URL: https://datasheet.ciiva.com/11819/0900766b8106beab-11819430.pdf?src-supplier=RSComponents; ComponentLink2Description: https://datasheet.ciiva.com/11819/0900766b8106beab-11819430.pdf?src-supplier=RSComponents; ComponentLink3URL: https://datasheet.ciiva.com/7941/1738694-7941862.pdf?src-supplier=Element14; ComponentLink3Description: https://datasheet.ciiva.com/7941/1738694-7941862.pdf?src-supplier=Element14; ComponentLink4URL: https://datasheet.ciiva.com/7941/1738694-7941863.pdf?src-supplier=Element14; ComponentLink4Description: https://datasheet.ciiva.com/7941/1738694-7941863.pdf?src-supplier=Element14; ComponentLink5URL: https://datasheet.ciiva.com/15190/getdatasheetpartid-330685-15190028.pdf?src-supplier=Verical; ComponentLink5Description: https://datasheet.ciiva.com/15190/getdatasheetpartid-330685-15190028.pdf?src-supplier=Verical
R9 = RC0805FR-07100KL: YAGEO         RC0805FR-07100KL            RES, THICK FILM, 100K, 1%, 0.125W, 0805, REEL; Resistance: 100kR; Temperature Coefficient: 100ppm/°C; Power Rating: 125mW; Voltage Rating (DC): 150V; Supplier 1: Digi-Key; Supplier Part Number 1: 311-100KCRCT-ND; Manufacturer: Yageo; Manufacturer Part Number: RC0805FR-07100KL; RoHS: Yes; Category: Chip SMD Resistors; Stock 1: 2509974; Pricing 1: 1=0,10000, 10=0,03600, 100=0,01470, 1000=0,00660, 2500=0,00573 (USD); Case/Package: 0805; Number of Pins: 2; Case Code (Metric): 2012; Case Code (Imperial): 0805; Min Operating Temperature: -55°C; Max Operating Temperature: 155°C; Resistor Type: Thick Film; Tolerance: 1%; Packaging: Tape and Reel; Voltage Rating: 150V; Package Quantity: 1; Number of Terminations: 2; Termination: SMD/SMT; Max Power Dissipation: 125mW; Features: Moisture Resistant; Length: 2mm; Width: 0.049inch; Height: 0.024inch; Depth: 1.25mm; Lead Pitch: 0.4mm; REACH SVHC: Unknown; Lead Free: Lead Free; Military Standard: Not; ComponentLink1URL: https://datasheet.ciiva.com/11808/0900766b8106beab-11808858.pdf?src-supplier=RSComponents; ComponentLink1Description: https://datasheet.ciiva.com/11808/0900766b8106beab-11808858.pdf?src-supplier=RSComponents; ComponentLink2URL: https://datasheet.ciiva.com/2457/pyu-r-int-thick-7-2457017.pdf?src-supplier=Digi-Key; ComponentLink2Description: https://datasheet.ciiva.com/2457/pyu-r-int-thick-7-2457017.pdf?src-supplier=Digi-Key; ComponentLink3URL: https://datasheet.ciiva.com/12667/rc0805-12667001.pdf?src-supplier=Mouser; ComponentLink3Description: https://datasheet.ciiva.com/12667/rc0805-12667001.pdf?src-supplier=Mouser; ComponentLink4URL: https://datasheet.ciiva.com/2457/pyu-r-int-thick-7-2457018.pdf?src-supplier=Digi-Key; ComponentLink4Description: https://datasheet.ciiva.com/2457/pyu-r-int-thick-7-2457018.pdf?src-supplier=Digi-Key; ComponentLink5URL: https://datasheet.ciiva.com/16747/rc0805-16747226.pdf?src-supplier=Future+Electronics; ComponentLink5Description: https://datasheet.ciiva.com/16747/rc0805-16747226.pdf?src-supplier=Future+Electronics; ComponentLink6URL: https://datasheet.ciiva.com/7941/1697719-7941678.pdf?src-supplier=Element14; ComponentLink6Description: https://datasheet.ciiva.com/7941/1697719-7941678.pdf?src-supplier=Element14; ComponentLink7URL: https://datasheet.ciiva.com/22747/444164-22747534.pdf?src-supplier=Element14; ComponentLink7Description: https://datasheet.ciiva.com/22747/444164-22747534.pdf?src-supplier=Element14; ComponentLink8URL: https://datasheet.ciiva.com/2457/pyu-r-int-thick-7-2457019.pdf?src-supplier=Digi-Key; ComponentLink8Description: https://datasheet.ciiva.com/2457/pyu-r-int-thick-7-2457019.pdf?src-supplier=Digi-Key; ComponentLink9URL: https://datasheet.ciiva.com/7660/38627-7660796.pdf?src-supplier=Element14; ComponentLink9Description: https://datasheet.ciiva.com/7660/38627-7660796.pdf?src-supplier=Element14; ComponentLink10URL: https://datasheet.ciiva.com/7941/1697719-7941676.pdf?src-supplier=Element14; ComponentLink10Description: https://datasheet.ciiva.com/7941/1697719-7941676.pdf?src-supplier=Element14; ComponentLink11URL: https://datasheet.ciiva.com/7941/1686128-7941677.pdf?src-supplier=Element14; ComponentLink11Description: https://datasheet.ciiva.com/7941/1686128-7941677.pdf?src-supplier=Element14